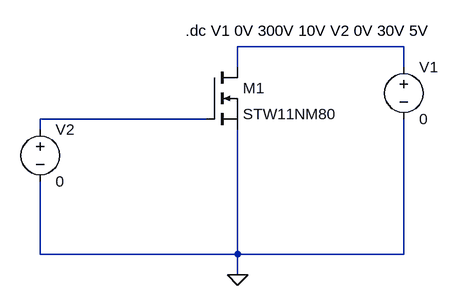
[diagram p0: schematic NMOS.asc]
NMOS.asc, the LTspice schematic file:
Version 4
SHEET 1 880 680
WIRE 464 80 208 80
WIRE 208 112 208 80
WIRE 464 112 464 80
WIRE 160 192 -96 192
WIRE -96 208 -96 192
WIRE -96 400 -96 288
WIRE 208 400 208 208
WIRE 208 400 -96 400
WIRE 464 400 464 192
WIRE 464 400 208 400
WIRE 208 432 208 400
FLAG 208 432 0
SYMBOL nmos 160 112 R0
SYMATTR InstName M1
SYMATTR Value STW11NM80
SYMBOL voltage 464 96 R0
SYMATTR InstName V1
SYMATTR Value 0
SYMBOL voltage -96 192 R0
WINDOW 123 0 0 Left 0
WINDOW 39 0 0 Left 0
SYMATTR InstName V2
SYMATTR Value 0
TEXT 128 56 Left 2 !.dc V1 0V 300V 10V V2 0V 30V 5V

The netlist it stands for:
* NMOS.asc
M1 N001 N002 0 0 STW11NM80
V1 N001 0 0
V2 N002 0 0
.model NMOS NMOS
.model PMOS PMOS
.lib standard.mos
.dc V1 0V 300V 10V V2 0V 30V 5V
.backanno
.end